# Altium schematic sheet MPR121.SchDoc
size A4; SheetNumber: 5; SheetTotal: 6
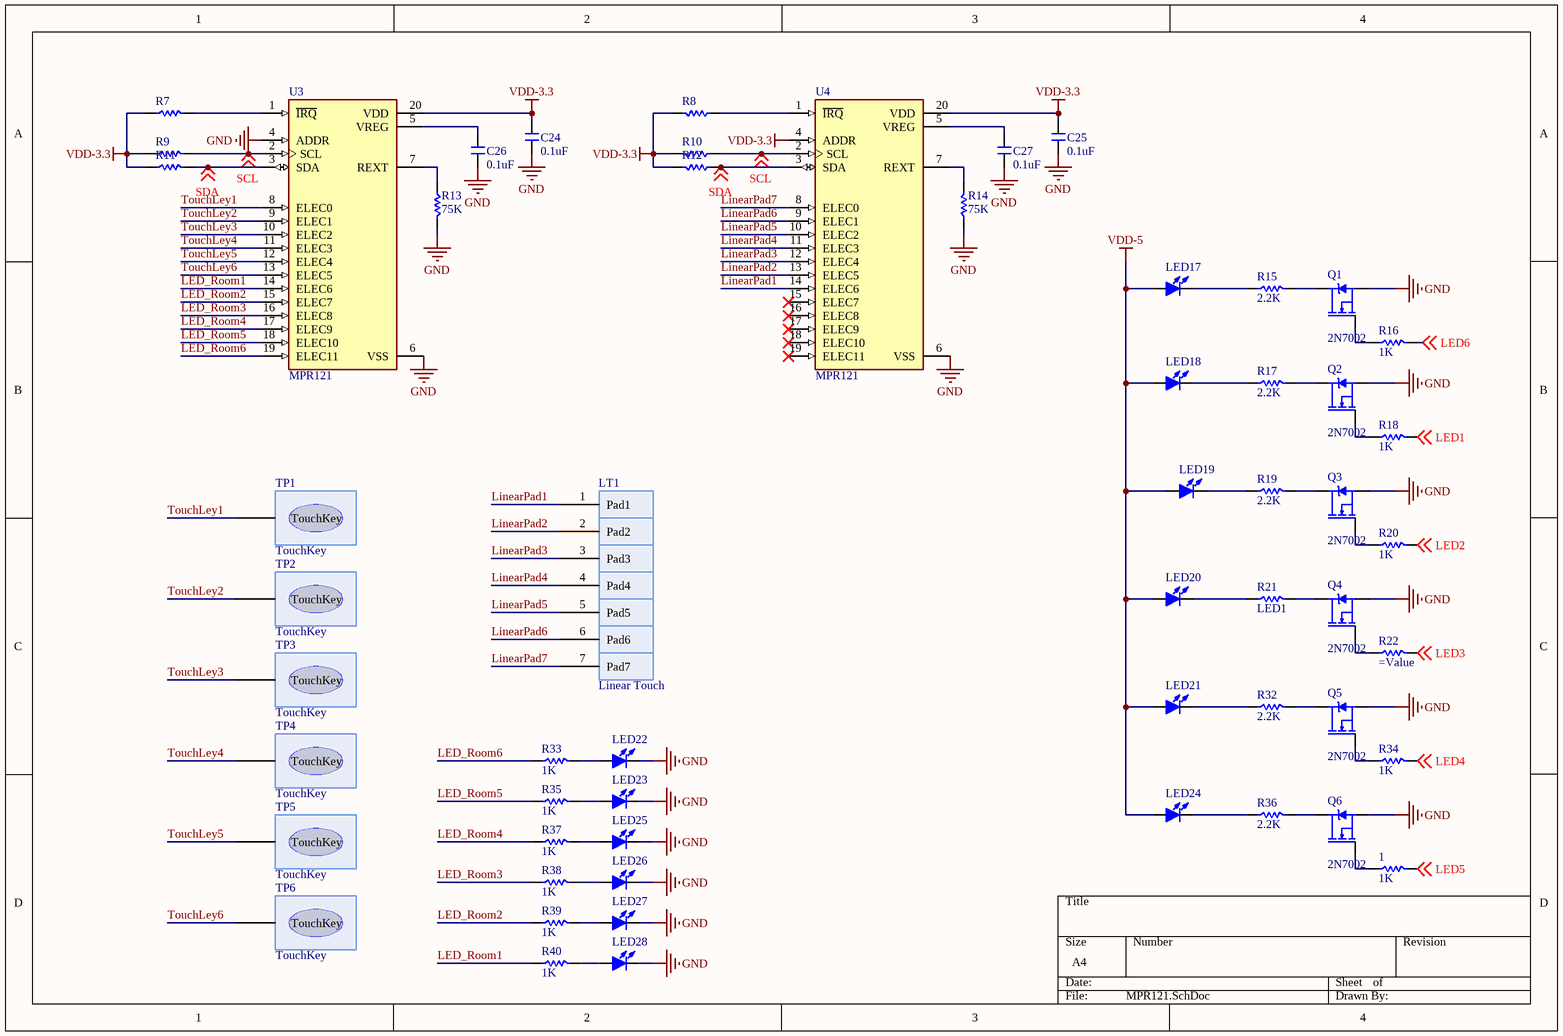
[diagram p0: MPR121.SchDoc]

## Parts
1  1K  [R 0805]
C24  0.1uF  [C 0603]
C25  0.1uF  [C 0603]
C26  0.1uF  [C 0603]
C27  0.1uF  [C 0603]
LED17  (no value)  [LED 3MM-B]
LED18  (no value)  [LED 3MM-B]
LED19  (no value)  [LED 3MM-B]
LED20  (no value)  [LED 3MM-B]
LED21  (no value)  [LED 3MM-B]
LED22  LED-SMD  [LED 1206Y]  (value not drawn)
LED23  LED-SMD  [LED 1206Y]  (value not drawn)
LED24  (no value)  [LED 3MM-B]
LED25  LED-SMD  [LED 1206Y]  (value not drawn)
LED26  LED-SMD  [LED 1206Y]  (value not drawn)
LED27  LED-SMD  [LED 1206Y]  (value not drawn)
LED28  LED-SMD  [LED 1206Y]  (value not drawn)
LT1  Linear Touch  [Linear TouchPad (7Pad)]
Q1  2N7002  [SOT23-3]
Q2  2N7002  [SOT23-3]
Q3  2N7002  [SOT23-3]
Q4  2N7002  [SOT23-3]
Q5  2N7002  [SOT23-3]
Q6  2N7002  [SOT23-3]
R7  (no value)  [R 0603]
R8  (no value)  [R 0603]
R9  (no value)  [R 0603]
R10  (no value)  [R 0603]
R11  (no value)  [R 0603]
R12  (no value)  [R 0603]
R13  75K  [R 0603]
R14  75K  [R 0603]
R15  2.2K  [R 0805]
R16  1K  [R 0805]
R17  2.2K  [R 0805]
R18  1K  [R 0805]
R19  2.2K  [R 0805]
R20  1K  [R 0805]
R21  LED1  [R 0805]
R22  (no value)  [R 0805]
R32  2.2K  [R 0805]
R33  1K  [R 0805]
R34  1K  [R 0805]
R35  1K  [R 0805]
R36  2.2K  [R 0805]
R37  1K  [R 0805]
R38  1K  [R 0805]
R39  1K  [R 0805]
R40  1K  [R 0805]
TP1  TouchKey  [Square TouchKey (1.5cm)]
TP2  TouchKey  [Square TouchKey (1.5cm)]
TP3  TouchKey  [Square TouchKey (1.5cm)]
TP4  TouchKey  [Square TouchKey (1.5cm)]
TP5  TouchKey  [Square TouchKey (1.5cm)]
TP6  TouchKey  [Square TouchKey (1.5cm)]
U3  MPR121  [QFN-20Pin]
U4  MPR121  [QFN-20Pin]

## Nets
GND: C24.1 C25.1 C26.1 C27.1 LED22.2(K) LED23.2(K) LED25.2(K) LED26.2(K) LED27.2(K) LED28.2(K) Q1.2(S) Q2.2(S) Q3.2(S) Q4.2(S) Q5.2(S) Q6.2(S) R13.2 R14.1 U3.4(ADDR) U3.6(VSS) U4.6(VSS)
VDD-3.3: C24.2 C25.2 R7.1 R8.2 R9.1 R10.2 R11.1 R12.2 U3.20(VDD) U4.4(ADDR) U4.20(VDD)
VDD-5: LED17.1(A) LED18.1(A) LED19.1(A) LED20.1(A) LED21.1(A) LED24.1(A)
LED1: R18.2 ; off-sheet LED1
LED2: R20.2 ; off-sheet LED2
LED3: R22.2 ; off-sheet LED3
LED4: R34.2 ; off-sheet LED4
LED5: 1.2 ; off-sheet LED5
LED6: R16.2 ; off-sheet LED6
LED_Room1: R40.1 U3.14(ELEC6)
LED_Room2: R39.1 U3.15(ELEC7)
LED_Room3: R38.1 U3.16(ELEC8)
LED_Room4: R37.1 U3.17(ELEC9)
LED_Room5: R35.1 U3.18(ELEC10)
LED_Room6: R33.1 U3.19(ELEC11)
LinearPad1: LT1.1(Pad1) U4.14(ELEC6)
LinearPad2: LT1.2(Pad2) U4.13(ELEC5)
LinearPad3: LT1.3(Pad3) U4.12(ELEC4)
LinearPad4: LT1.4(Pad4) U4.11(ELEC3)
LinearPad5: LT1.5(Pad5) U4.10(ELEC2)
LinearPad6: LT1.6(Pad6) U4.9(ELEC1)
LinearPad7: LT1.7(Pad7) U4.8(ELEC0)
SCL: R9.2 R10.1 U3.2(SCL) U4.2(SCL) ; off-sheet SCL
SDA: R11.2 R12.1 U3.3(SDA) U4.3(SDA) ; off-sheet SDA
TouchLey1: TP1.1(TouchKey) U3.8(ELEC0)
TouchLey2: TP2.1(TouchKey) U3.9(ELEC1)
TouchLey3: TP3.1(TouchKey) U3.10(ELEC2)
TouchLey4: TP4.1(TouchKey) U3.11(ELEC3)
TouchLey5: TP5.1(TouchKey) U3.12(ELEC4)
TouchLey6: TP6.1(TouchKey) U3.13(ELEC5)
Net1_1: 1.1 Q6.1(G)
NetC26_2: C26.2 U3.5(VREG)
NetC27_2: C27.2 U4.5(VREG)
NetLED17_2: LED17.2(K) R15.1
NetLED18_2: LED18.2(K) R17.1
NetLED19_2: LED19.2(K) R19.1
NetLED20_2: LED20.2(K) R21.1
NetLED21_2: LED21.2(K) R32.1
NetLED22_1: LED22.1(A) R33.2
NetLED23_1: LED23.1(A) R35.2
NetLED24_2: LED24.2(K) R36.1
NetLED25_1: LED25.1(A) R37.2
NetLED26_1: LED26.1(A) R38.2
NetLED27_1: LED27.1(A) R39.2
NetLED28_1: LED28.1(A) R40.2
NetQ1_1: Q1.1(G) R16.1
NetQ1_3: Q1.3(D) R15.2
NetQ2_1: Q2.1(G) R18.1
NetQ2_3: Q2.3(D) R17.2
NetQ3_1: Q3.1(G) R20.1
NetQ3_3: Q3.3(D) R19.2
NetQ4_1: Q4.1(G) R22.1
NetQ4_3: Q4.3(D) R21.2
NetQ5_1: Q5.1(G) R34.1
NetQ5_3: Q5.3(D) R32.2
NetQ6_3: Q6.3(D) R36.2
NetR7_2: R7.2 U3.1(~{IRQ})
NetR8_1: R8.1 U4.1(~{IRQ})
NetR13_1: R13.1 U3.7(REXT)
NetR14_2: R14.2 U4.7(REXT)

Not connected (* = marked no-connect by the designer): U4 15(ELEC7)* 16(ELEC8)* 17(ELEC9)* 18(ELEC10)* 19(ELEC11)*

## Library data of the parts
1 R7-R22 R32-R40 = R: Chip resistor; 版权归属: 源创客; BOM名称: Chip resistor; 学习资源: www.ooocke.com
C24-C27 = C: Non-polar patch capacitor; BOM名称: 无极性贴片电容; 版权归属: 源创客; 学习资源: www.ooocke.com
LED17-LED21 LED24 = LED-3MM: Plug-in LED; BOM名称: 插件LED; 版权归属: 源创客; 学习资源: www.ooocke.com
LED22 LED23 LED25-LED28 = LED-SMD: Patch LED; BOM名称: 贴片LED; 版权归属: 源创客; 学习资源: www.ooocke.com
Q1-Q6 = 2N7002: N-Channel 60V 115mA (Tc) 225mW (Ta) Surface Mount SOT-23-3 (TO-236); MF: STMicroelectronics; Package: SOT-23-3 Vishay; Value: *; Check_prices: https://www.snapeda.com/parts/2N7002/STMicroelectronics/view-part/2885412/?ref=eda; SnapEDA_Link: https://www.snapeda.com/parts/2N7002/STMicroelectronics/view-part/2885412/?ref=snap; Availability: Good; Price: None; MP: 2N7002; Purchase-URL: https://pricing.snapeda.com/search/part/2N7002/?ref=eda